# Altium schematic sheet MCU025A_Connectors.SchDoc
size 431 x 279 mm; Date: Not shown in title block; ApprovedBy: Not shown in title block; CheckedBy: Not shown in title block; Author: Not shown in title block; CompanyName: Not shown in title block; Engineer: Not shown in title block; Organization: Not shown in title block; Address1: Not shown in title block; Address2: Not shown in title block; Address3: Not shown in title block; Address4: Not shown in title block; DocumentNumber: 2; Revision: Use project parameter SCH_Rev; SheetNumber: 2; SheetTotal: 8; PageSetup: Record=PageOptions|CenterHorizontal=True|CenterVertical=True|PrintScale=1.00|XCorrection=1.00|YCorrection=1.00|PrintKind=0|BorderSize=5000000|LeftOffset=0|BottomOffset=0|Orientation=2|PaperLength=1000|PaperWidth=1000|Scale=100|PaperSource=15|PrintQuality=600|MediaType=1|DitherType=10|PaperKind=Letter|PrintScaleMode=1; CurrentTime: Not shown in title block; CurrentDate: Not shown in title block; Time: Not shown in title block; DocumentFullPathAndName: Not shown in title block; DocumentName: Not shown in title block; ModifiedDate: Not shown in title block; ImagePath: Not shown in title block
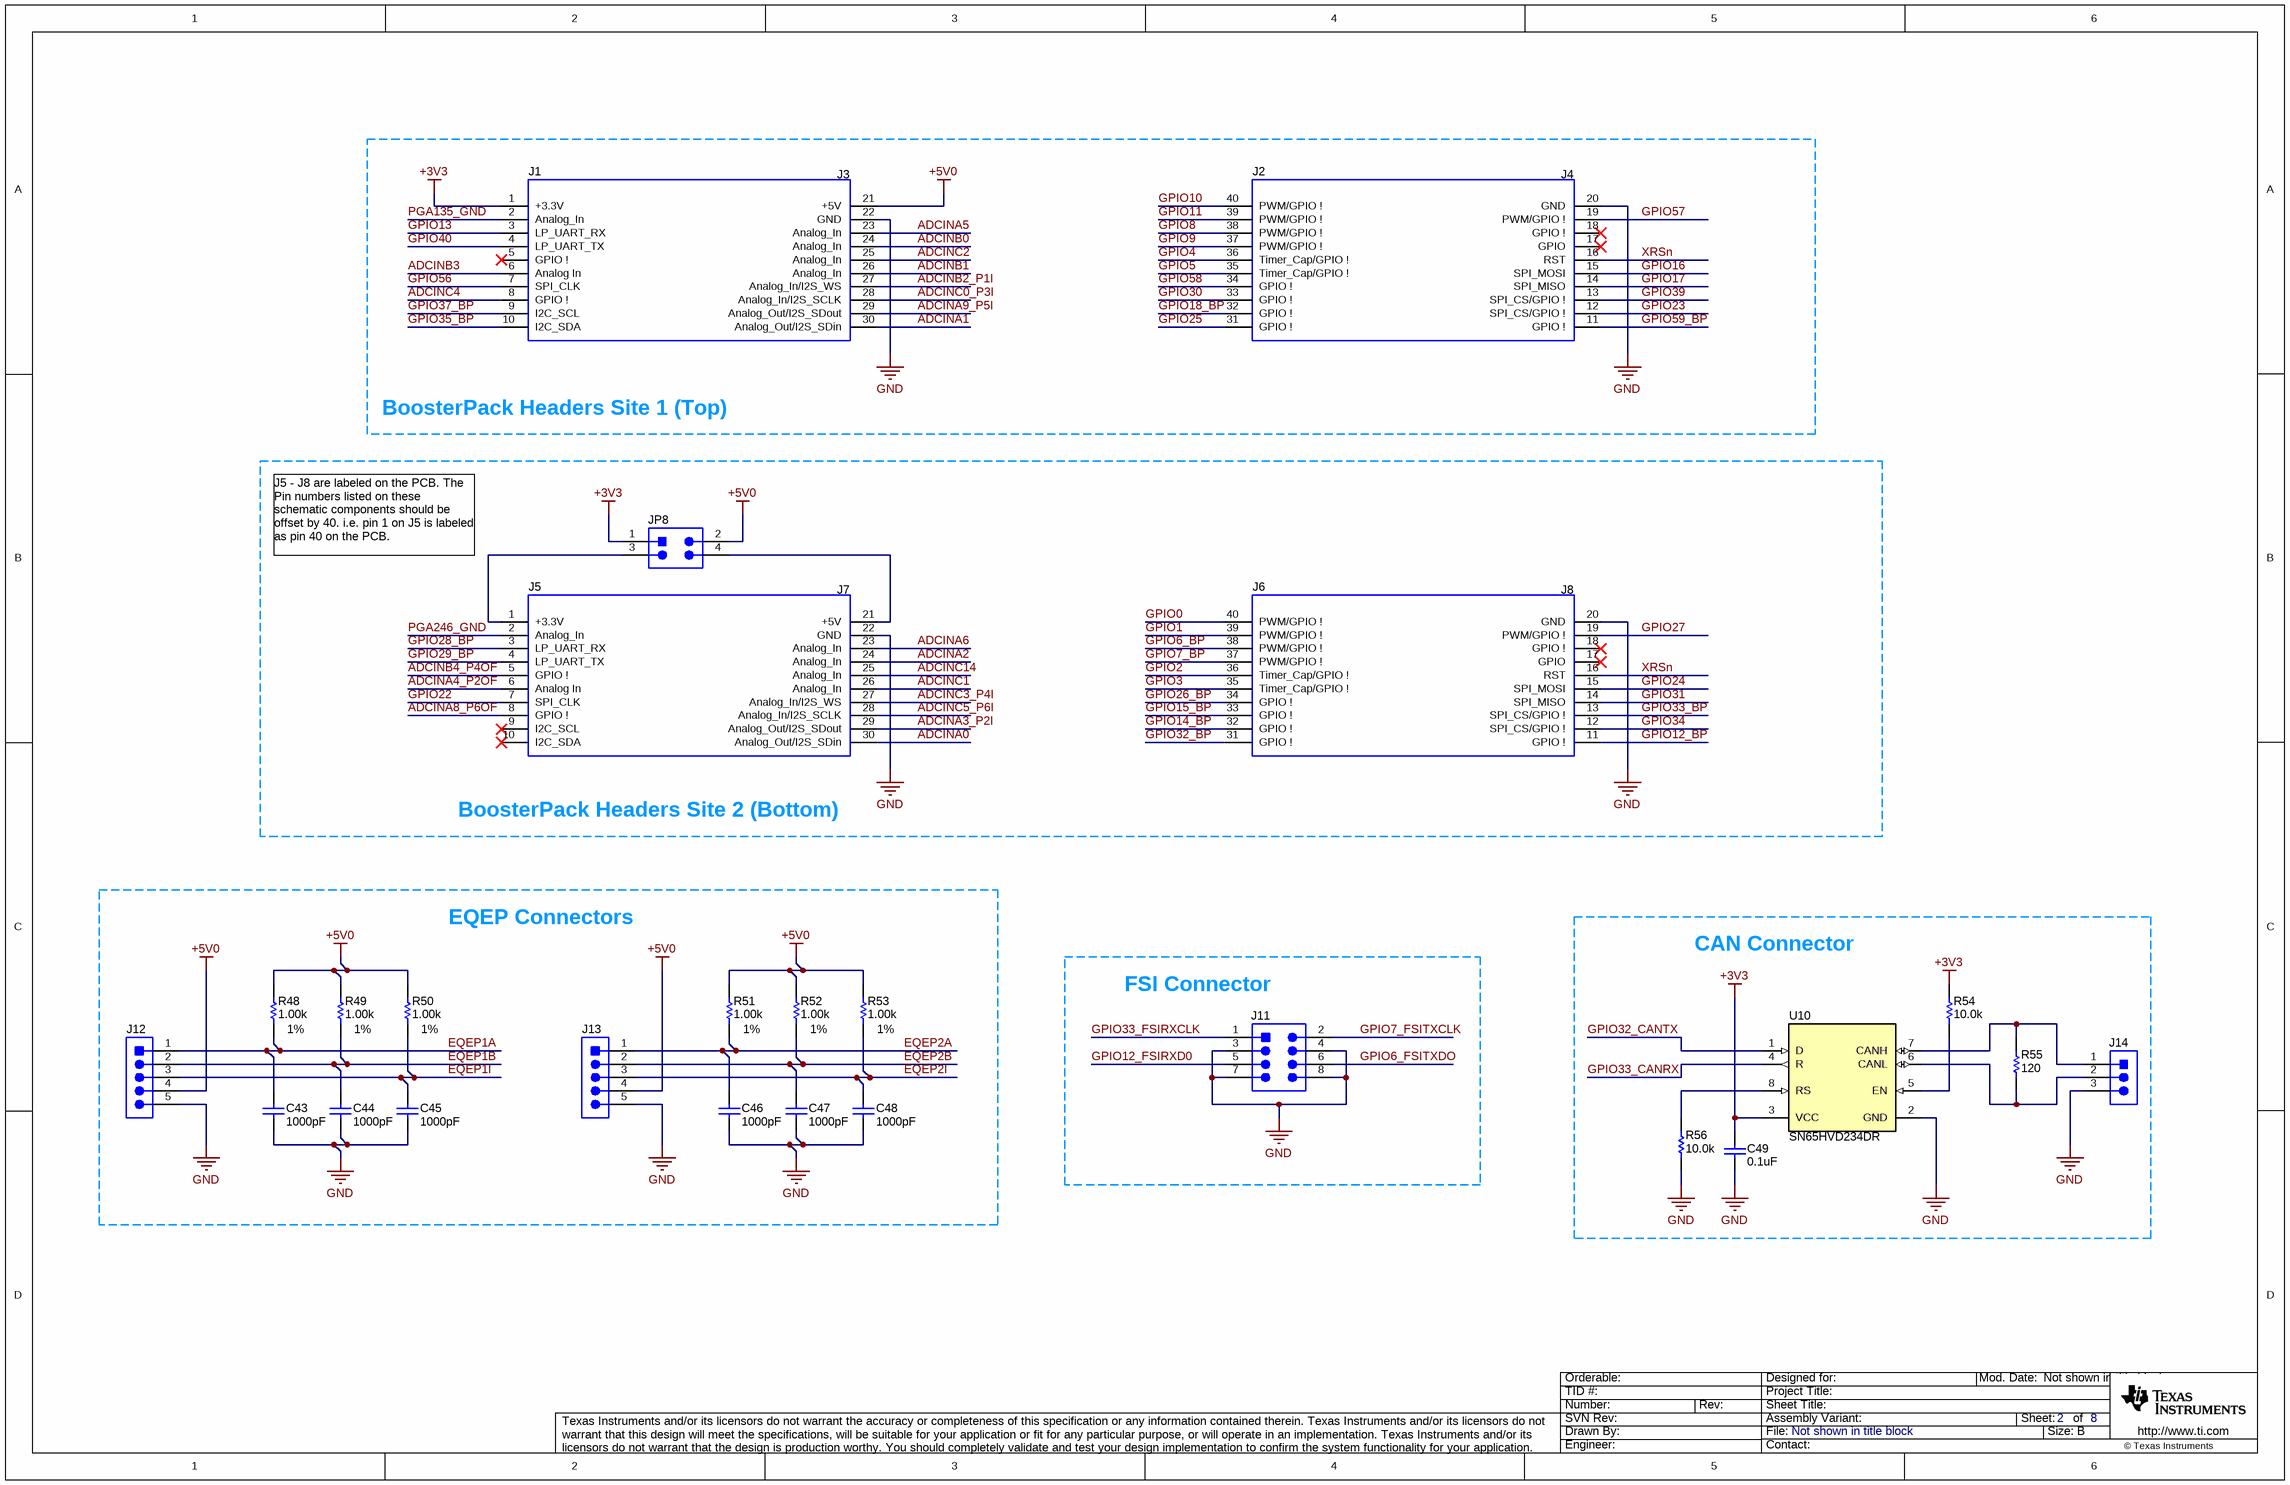
[diagram p0: MCU025A_Connectors.SchDoc]

## Parts
C43  ValueDisplayed: 1000pF  [0402]  (hidden comment: GRM155R71H102KA01D)
C44  ValueDisplayed: 1000pF  [0402]  (hidden comment: GRM155R71H102KA01D)
C45  ValueDisplayed: 1000pF  [0402]  (hidden comment: GRM155R71H102KA01D)
C46  ValueDisplayed: 1000pF  [0402]  (hidden comment: GRM155R71H102KA01D)
C47  ValueDisplayed: 1000pF  [0402]  (hidden comment: GRM155R71H102KA01D)
C48  ValueDisplayed: 1000pF  [0402]  (hidden comment: GRM155R71H102KA01D)
C49  ValueDisplayed: 0.1uF  [0402]  (hidden comment: GRM155R71A104KA01D)
J1  SSQ-110-03-T-D  [BoosterPack_40pin_J1J3]  (value not drawn)
J2  SSQ-110-03-T-D  [BoosterPack_40pin_J2J4]  (value not drawn)
J5  SSQ-110-03-T-D  [BoosterPack_40pin_J1J3]  (value not drawn)
J6  SSQ-110-03-T-D  [BoosterPack_40pin_J2J4]  (value not drawn)
J11  TSW-104-07-G-D  [TSW-104-07-G-D]  (value not drawn)
J12  TSW-105-07-G-S  [TSW-105-07-X-S]  (value not drawn)
J13  TSW-105-07-G-S  [TSW-105-07-X-S]  (value not drawn)
J14  61300311121  [WURTH_61300311121]  (value not drawn)
JP8  TSW-102-07-G-D  [TSW-102-07-G-D]  (value not drawn)
R48  ValueDisplayed: 1.00k  Value1: 1%  [0402]  (hidden comment: CRCW04021K00FKED)
R49  ValueDisplayed: 1.00k  Value1: 1%  [0402]  (hidden comment: CRCW04021K00FKED)
R50  ValueDisplayed: 1.00k  Value1: 1%  [0402]  (hidden comment: CRCW04021K00FKED)
R51  ValueDisplayed: 1.00k  Value1: 1%  [0402]  (hidden comment: CRCW04021K00FKED)
R52  ValueDisplayed: 1.00k  Value1: 1%  [0402]  (hidden comment: CRCW04021K00FKED)
R53  ValueDisplayed: 1.00k  Value1: 1%  [0402]  (hidden comment: CRCW04021K00FKED)
R54  ValueDisplayed: 10.0k  [0402]  (hidden comment: CRCW040210K0FKED)
R55  ValueDisplayed: 120  [0603]  (hidden comment: RC0603FR-07120RL)
R56  ValueDisplayed: 10.0k  [0402]  (hidden comment: CRCW040210K0FKED)
U10  SN65HVD234DR  [D0008A_L]

## Nets
+3V3: C49.2 J1.1(+3.3V) JP8.1 R54.2 U10.3(VCC)
+5V0: J1.21(+5V) J12.4 J13.4 JP8.2 R48.2 R49.2 R50.2 R51.2 R52.2 R53.2
GND: C43.2 C44.2 C45.2 C46.2 C47.2 C48.2 C49.1 J1.22(GND) J2.20(GND) J5.22(GND) J6.20(GND) J11.3 J11.4 J11.7 J11.8 J12.5 J13.5 J14.3 R56.1 U10.2(GND)
ADCINA0: J5.30(Analog_Out/I2S_SDin)
ADCINA1: J1.30(Analog_Out/I2S_SDin)
ADCINA2: J5.24(Analog_In)
ADCINA3_P2I: J5.29(Analog_Out/I2S_SDout)
ADCINA4_P2OF: J5.6(Analog_In)
ADCINA5: J1.23(Analog_In)
ADCINA6: J5.23(Analog_In)
ADCINA8_P6OF: J5.8(GPIO_!)
ADCINA9_P5I: J1.29(Analog_Out/I2S_SDout)
ADCINB0: J1.24(Analog_In)
ADCINB1: J1.26(Analog_In)
ADCINB2_P1I: J1.27(Analog_In/I2S_WS)
ADCINB3: J1.6(Analog_In)
ADCINB4_P4OF: J5.5(GPIO_!)
ADCINC0_P3I: J1.28(Analog_In/I2S_SCLK)
ADCINC1: J5.26(Analog_In)
ADCINC2: J1.25(Analog_In)
ADCINC3_P4I: J5.27(Analog_In/I2S_WS)
ADCINC4: J1.8(GPIO_!)
ADCINC5_P6I: J5.28(Analog_In/I2S_SCLK)
ADCINC14: J5.25(Analog_In)
EQEP1A: C43.1 J12.1 R48.1
EQEP1B: C44.1 J12.2 R49.1
EQEP1I: C45.1 J12.3 R50.1
EQEP2A: C46.1 J13.1 R51.1
EQEP2B: C47.1 J13.2 R52.1
EQEP2I: C48.1 J13.3 R53.1
GPIO0: J6.40(PWM/GPIO_!)
GPIO1: J6.39(PWM/GPIO_!)
GPIO2: J6.36(Timer_Cap/GPIO_!)
GPIO3: J6.35(Timer_Cap/GPIO_!)
GPIO4: J2.36(Timer_Cap/GPIO_!)
GPIO5: J2.35(Timer_Cap/GPIO_!)
GPIO6_BP: J6.38(PWM/GPIO_!)
GPIO6_FSITXDO: J11.6
GPIO7_BP: J6.37(PWM/GPIO_!)
GPIO7_FSITXCLK: J11.2
GPIO8: J2.38(PWM/GPIO_!)
GPIO9: J2.37(PWM/GPIO_!)
GPIO10: J2.40(PWM/GPIO_!)
GPIO11: J2.39(PWM/GPIO_!)
GPIO12_BP: J6.11(GPIO_!)
GPIO12_FSIRXD0: J11.5
GPIO13: J1.3(LP_UART_RX)
GPIO14_BP: J6.32(GPIO_!)
GPIO15_BP: J6.33(GPIO_!)
GPIO16: J2.15(SPI_MOSI)
GPIO17: J2.14(SPI_MISO)
GPIO18_BP: J2.32(GPIO_!)
GPIO22: J5.7(SPI_CLK)
GPIO23: J2.12(SPI_CS/GPIO_!)
GPIO24: J6.15(SPI_MOSI)
GPIO25: J2.31(GPIO_!)
GPIO26_BP: J6.34(GPIO_!)
GPIO27: J6.19(PWM/GPIO_!)
GPIO28_BP: J5.3(LP_UART_RX)
GPIO29_BP: J5.4(LP_UART_TX)
GPIO30: J2.33(GPIO_!)
GPIO31: J6.14(SPI_MISO)
GPIO32_BP: J6.31(GPIO_!)
GPIO32_CANTX: U10.1(D)
GPIO33_BP: J6.13(SPI_CS/GPIO_!)
GPIO33_CANRX: U10.4(R)
GPIO33_FSIRXCLK: J11.1
GPIO34: J6.12(SPI_CS/GPIO_!)
GPIO35_BP: J1.10(I2C_SDA)
GPIO37_BP: J1.9(I2C_SCL)
GPIO39: J2.13(SPI_CS/GPIO_!)
GPIO40: J1.4(LP_UART_TX)
GPIO56: J1.7(SPI_CLK)
GPIO57: J2.19(PWM/GPIO_!)
GPIO58: J2.34(GPIO_!)
GPIO59_BP: J2.11(GPIO_!)
PGA135_GND: J1.2(Analog_In)
PGA246_GND: J5.2(Analog_In)
XRSn: J2.16(RST) J6.16(RST)
NetJ5_1: J5.1(+3.3V) JP8.3
NetJ5_21: J5.21(+5V) JP8.4
NetJ14_1: J14.1 R55.2 U10.7(CANH)
NetJ14_2: J14.2 R55.1 U10.6(CANL)
NetR54_1: R54.1 U10.5(EN)
NetR56_2: R56.2 U10.8(RS)

Not connected (* = marked no-connect by the designer): J1 5(GPIO_!)*; J2 17(GPIO)* 18(GPIO_!)*; J5 9(I2C_SCL)* 10(I2C_SDA)*; J6 17(GPIO)* 18(GPIO_!)*

## Notes on the sheet
- (near J1) J3
- (near J2) J4
- BoosterPack Headers Site 1 (Top)
- J5 - J8 are labeled on the PCB. The Pin numbers listed on these schematic components should be offset by 40. i.e. pin 1 on J5 is labeled as pin 40 on the PCB.
- (near J5) J7
- (near J6) J8
- BoosterPack Headers Site 2 (Bottom)
- EQEP Connectors
- CAN Connector
- (near J11) FSI Connector
- Drawn By:
- SVN Rev:
- Number:
- TID #:
- Orderable:
- Rev:
- Sheet Title:
- File:
- Project Title:
- Designed for:
- Assembly Variant:
- Mod. Date:
- Sheet:
- Size:
- of
- B
- http://www.ti.com
- Texas Instruments and/or its licensors do not warrant the accuracy or completeness of this specification or any information contained therein. Texas Instruments and/or its licensors do not warrant that this design will meet the specifications, will be suitable for your application or fit for any particular purpose, or will operate in an implementation. Texas Instruments and/or its licensors do not warrant that the design is production worthy. You should completely validate and test your design implementation to confirm the system functionality for your application.
- Engineer:
- Contact:
- © Texas Instruments

## Library data of the parts
C43-C48 = CMP-0006673-2: CAP, CERM, 1000 pF, 50 V, +/- 10%, X7R, 0402; Manufacturer: MuRata; Polarized: N; Value: 1000pF; U/M: EA; Cap_F: 1nF; Value1: Unknown; VDC_V: 50V; TaMin_C: -55°C; TaMax_C: 125°C; SizeArea_mm2: 0.5; SizeAreaWB_mm2: 3; SizeX_mm: 1; SizeZ_mm: 0.6; AEC Category: Q200; CompType: Capacitor; PartNumber: GRM155R71H102KA01D; PackageReference: 0402; RoHS: Y; Tolerance_%: 10%; Value2: 50V; MountType: SMT; Technology: Ceramic; TempCo: X7R; Cap_Case: 0402; SizeY_mm: 0.5; Published: 2008-06-19; Publisher: Texas Instruments; LatestRevisionDate: 2017-03-09; ComponentLink1Description: Datasheet link; ComponentLink1URL: http://search.murata.co.jp/Ceramy/PnsearchViewAction.do?HnOFG=ON&HnNFG=ON&SEL_CNT=50&sLang=en&sKey=GRM155R71H102KA01D&x=9&y=9&search=startwith; Supplier 1: Digi-Key; Supplier Part Number 1: 490-1303-1-ND; Supplier 2: Newark; Supplier Part Number 2: 14T3283; Supplier 3: Mouser; Supplier Part Number 3: 81-GRM36X102K50; AEC Qualified: ?
C49 = CMP-0006629-2: CAP, CERM, 0.1 uF, 10 V, +/- 10%, X7R, 0402; Manufacturer: MuRata; Polarized: N; Value: 0.1uF; U/M: EA; Cap_F: 100nF; Value1: Unknown; VDC_V: 10V; TaMin_C: -55°C; TaMax_C: 125°C; SizeArea_mm2: 0.5; SizeAreaWB_mm2: 3; SizeX_mm: 1; SizeZ_mm: 0.6; AEC Category: Q200; CompType: Capacitor; PartNumber: GRM155R71A104KA01D; PackageReference: 0402; RoHS: Y; Tolerance_%: 10%; Value2: 10V; MountType: SMT; Technology: Ceramic; TempCo: X7R; Cap_Case: 0402; SizeY_mm: 0.5; Published: 2008-06-19; Publisher: Texas Instruments; LatestRevisionDate: 2017-03-09; ComponentLink1Description: Datasheet link; ComponentLink1URL: http://search.murata.co.jp/Ceramy/PnsearchViewAction.do?HnOFG=ON&HnNFG=ON&SEL_CNT=50&sLang=en&sKey=GRM155R71A104KA01D&x=9&y=9&search=startwith; Supplier 1: Digi-Key; Supplier Part Number 1: GRM155R71A104KA01D-ND; Supplier 2: Newark; Supplier Part Number 2: 14T3278; Supplier 3: Mouser; Supplier Part Number 3: 81-GRM155R71A104KA1D; AEC Qualified: ?
J1 J5 = CMP-0003837-2: Receptacle, 2.54mm, 10x2, Tin, TH; Manufacturer: Samtec; Alternate Manufacturer: Major League Electronics; Alternate PartNumber: CRD-081413-A-G; Note: Booster Pack 40 pin J1 and J3; Green_Lifecycle: Active; Green_REACh: Incomplete; CompType: Receptacle; PartNumber: SSQ-110-03-T-D; RoHS: Y; PackageReference: 10x2 Receptacle; MountType: TH; ComponentLink1Description: Datasheet Link; ComponentLink1URL: https://www.samtec.com/ftppub/cpdf/SSQ-1XX-XX-XXX-X-XX-XXX-XX-X-MKT.pdf; Supplier 1: Digi-Key; Supplier Part Number 1: SAM1204-10-ND; Supplier 2: Newark; Supplier Part Number 2: 11P8392; Green_EU RoHS-2: Passed; Green_EU RoHS: Passed
J2 J6 = CMP-0078266-2: Receptacle, 2.54mm, 10x2, Tin, TH; Manufacturer: Samtec; Alternate Manufacturer: Major League Electronics; Alternate PartNumber: CRD-081413-A-G; Note: Booster Pack 40 pin J2 and J4; Green_Lifecycle: Active; Green_REACh: Incomplete; CompType: Receptacle; PartNumber: SSQ-110-03-T-D; RoHS: Y; PackageReference: 10x2 Receptacle; MountType: TH; ComponentLink1Description: Datasheet Link; Supplier 1: Digi-Key; Supplier Part Number 1: SAM1204-10-ND; Green_EU RoHS: Passed; Green_EU RoHS-2: Passed; ComponentLink1URL: https://www.samtec.com/ftppub/cpdf/SSQ-1XX-XX-XXX-X-XX-XXX-XX-X-MKT.pdf; Supplier 2: Newark; Supplier Part Number 2: 11P8392
J11 = CMP-0075408-1: Header, 100mil, 4x2, Gold, TH; Manufacturer: Samtec; Pitch_mm: 2.54; Cert_VDE: N; Gender: Male; Cert_CSA: Y; Voltage_V: 550V; Green_REACh: Passed; Current_A: 6.3A; CT: False; Green_Lifecycle: Active; Row_Count: 2; CNHeader: True; ComponentLink1Description: Datasheet URL; RoHS: Y; Supplier 1: Digi-Key; Cert_UL: Y; Orientation: Vertical; Green_EU RoHS: Passed; PackageReference: 4x2 Header; Color: Black; PartNumber: TSW-104-07-G-D; PinCount: 8; Publisher: Texas Instruments; ContactFinish: Gold; Cert_CULUS: N; Shrouded: N; ClassName: Header; RowSpacing_mm: 2.54; ComponentLink1URL: http://samtec.com/ftppub/pdf/TSW_TH.PDF; LatestRevisionDate: 2017-07-12; CompType: Header; MountType: TH; Supplier Part Number 1: SAM1028-04-ND; Green_EU RoHS-2: Passed
J12 J13 = CMP-0075411-1: Header, 100mil, 5x1, Gold, TH; Manufacturer: Samtec; Pitch_mm: 2.54; Cert_VDE: N; Gender: Male; Cert_CSA: Y; Voltage_V: 550V; Green_REACh: Passed; Current_A: 6.3A; CT: False; Green_Lifecycle: Active; Row_Count: 1; CNHeader: True; ComponentLink1Description: Datasheet URL; RoHS: Y; Supplier 1: Digi-Key; Cert_UL: Y; Orientation: Vertical; Green_EU RoHS: Passed; PackageReference: 5x1 Header; Color: Black; PartNumber: TSW-105-07-G-S; PinCount: 5; Publisher: Texas Instruments; ContactFinish: Gold; Cert_CULUS: N; Shrouded: N; ClassName: Header; ComponentLink1URL: http://samtec.com/ftppub/pdf/TSW_TH.PDF; LatestRevisionDate: 2017-07-12; CompType: Header; MountType: TH; Supplier Part Number 1: SAM1029-05-ND; Green_EU RoHS-2: Passed
J14 = CMP-0054796-1: Header, 2.54 mm, 3x1, Gold, TH; Manufacturer: Wurth Elektronik; Green_Lifecycle: Active; Green_REACh: Passed; CNHeader: TRUE; CT: FALSE; PartNumber: 61300311121; PackageReference: Header, 2.54mm, 3x1, TH; ClassName: Header; CompType: Header; RoHS: Y; MountType: TH; ComponentLink1Description: Datasheet URL; ComponentLink1URL: http://katalog.we-online.de/em/datasheet/6130xx11121.pdf; Publisher: Texas Instruments; LatestRevisionDate: 26/05/2017; Supplier 1: Digi-Key; Supplier Part Number 1: 732-5316-ND; Supplier 2: Newark; Supplier Part Number 2: 20X0950; Supplier 3: Farnell; Supplier Part Number 3: 356154; Green_EU RoHS: Passed; Green_EU RoHS-2: Incomplete
JP8 = CMP-0075404-1: Header, 100mil, 2x2, Gold, TH; Manufacturer: Samtec; CNHeader: True; Shrouded: N; Gender: Male; Row_Count: 2; RowSpacing_mm: 2.54; CT: False; Cert_CSA: Y; Current_A: 6.3A; Green_Lifecycle: Active; Green_REACh: Passed; Voltage_V: 550V; ComponentLink1URL: http://samtec.com/ftppub/pdf/TSW_TH.PDF; ClassName: Header; Publisher: Texas Instruments; Color: Black; RoHS: Y; MountType: TH; Supplier 1: Digi-Key; PackageReference: 2x2 Header; PinCount: 4; CompType: Header; LatestRevisionDate: 2017-07-12; PartNumber: TSW-102-07-G-D; Orientation: Vertical; ComponentLink1Description: Datasheet URL; Supplier Part Number 1: SAM1028-02-ND; Pitch_mm: 2.54; ContactFinish: Gold; Cert_CULUS: N; Cert_UL: Y; Cert_VDE: N; Green_EU RoHS: Passed; Green_EU RoHS-2: Passed
R48-R53 = CMP-0026071-3: RES, 1.00 k, 1%, 0.063 W, AEC-Q200 Grade 0, 0402; Manufacturer: Vishay-Dale; Value: 1.00k; Res_ohm: 1k; Value_Code: 1k00; Power_W: 63mW; Value2: 0.063W; VDC_V: 50V; TempCo: 100 ppm/C; SizeArea_mm2: 0.5; SizeX_mm: 1; SizeZ_mm: 0.6; EIA_Code: E96; AEC Category: Q200; AEC Qualified: Y; AEC Grade: 0; CompType: Resistor; PartNumber: CRCW04021K00FKED; PackageReference: 0402; RoHS: E; Tolerance_%: 1%; MountType: SMT; Technology: Thick Film; SizeY_mm: 0.5; ComponentLink1Description: Datasheet link; ComponentLink1URL: http://www.vishay.com/docs/20035/dcrcwe3.pdf; Supplier 1: Digi-Key; Supplier Part Number 1: 541-1.00KLCT-ND; Supplier 2: Newark; Supplier Part Number 2: 52K6545; Supplier 3: Mouser; Supplier Part Number 3: 71-CRCW0402-1.0K-E3
R54 R56 = CMP-0025958-3: RES, 10.0 k, 1%, 0.063 W, AEC-Q200 Grade 0, 0402; Manufacturer: Vishay-Dale; Value: 10.0k; Res_ohm: 10k; Value_Code: 10k0; Power_W: 63mW; Value2: 0.063W; VDC_V: 50V; TempCo: 100 ppm/C; SizeArea_mm2: 0.5; SizeX_mm: 1; SizeZ_mm: 0.6; EIA_Code: E96; AEC Category: Q200; AEC Qualified: Y; AEC Grade: 0; CompType: Resistor; PartNumber: CRCW040210K0FKED; PackageReference: 0402; RoHS: E; Tolerance_%: 1%; Value1: 1%; MountType: SMT; Technology: Thick Film; SizeY_mm: 0.5; ComponentLink1Description: Datasheet link; ComponentLink1URL: http://www.vishay.com/docs/20035/dcrcwe3.pdf; Supplier 1: Digi-Key; Supplier Part Number 1: 541-10.0KLCT-ND; Supplier 2: Newark; Supplier Part Number 2: 52K6595; Supplier 3: Mouser; Supplier Part Number 3: 71-CRCW0402-10K-E3
R55 = CMP-0022769-3: RES, 120, 1%, 0.1 W, 0603; Manufacturer: Yageo America; Value: 120; Value_Code: 120R; Power_W: 100mW; Value2: 0.1W; VDC_V: 150V; TempCo: 200 ppm/C; SizeArea_mm2: 1.28; SizeX_mm: 1.6; SizeY_mm: 0.8; SizeZ_mm: 1; U/M: EA; AEC Category: Q200; CompType: Resistor; PartNumber: RC0603FR-07120RL; PackageReference: 0603; RoHS: Y; Res_ohm: 120; Tolerance_%: 1%; Value1: 1%; MountType: SMT; Technology: Thick Film; Published: 2008-06-26; Publisher: Texas Instruments; LatestRevisionDate: 2017-03-09; ComponentLink1Description: Datasheet link; ComponentLink1URL: http://www.yageo.com/pdf/Pu-RC0603_51_PbFree_L_2.pdf; Supplier 1: Digi-Key; Supplier Part Number 1: 311-120HRCT-ND; Supplier 2: Mouser; Supplier Part Number 2: 603-RC0603FR-07120RL; Supplier 3: Farnell; Supplier Part Number 3: 9238379; AEC Qualified: ?
U10 = CMP-0033355-1: 3.3V CAN Transceiver with Sleep Mode, 6 mA, -40 to 125 degC, 8-pin SOIC (D), Green (RoHS & no Sb/Br); Manufacturer: Texas Instruments; Drivers Per Package: 1; Bus Fault Voltage(V): +/-30; Transient Pulse Protection(V): -100 to 100; ICC(Max)(mA): 6; Supply Voltage(s)(V): 3.3; Rating: Catalog; DatasheetVersion: SLLS557F; PackageVersion: revM, Jun-2011; PackageReference: D0008A; PackageDescription: 8-Pin Plastic Small Outline Integrated Circuit, 4.9 x 3.9 mm, Pitch 1.27 mm Pitch; Eco-Plan: Green (RoHS & no Sb/Br); SubFamily: CAN; Receivers Per Package: 1; Isolated: No; Low Power Mode: Sleep; Footprint: PCA82C250, excludes pin5; PartNumber: SN65HVD234DR; Code_JEDEC: MS-012AA; ComponentLink1Description: Datasheet; ComponentLink1URL: http://www.ti.com/general/docs/lit/getliterature.tsp?genericPartNumber=SN65HVD234&fileType=pdf; Mounting Technology: Surface Mount